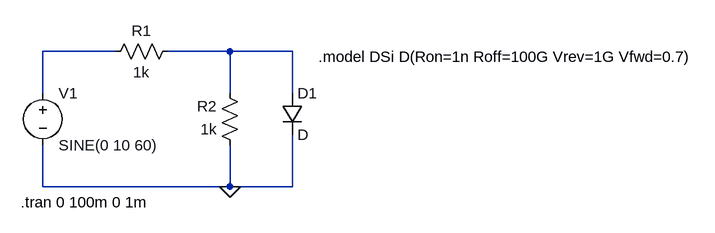
[diagram p0: schematic LucasSantosdeLuccaExercicio18.asc]
LucasSantosdeLuccaExercicio18.asc, the LTspice schematic file:
Version 4
SHEET 1 1020 680
WIRE 80 32 -32 32
WIRE 256 32 160 32
WIRE 352 32 256 32
WIRE -32 96 -32 32
WIRE 256 96 256 32
WIRE 352 96 352 32
WIRE -32 240 -32 176
WIRE 256 240 256 176
WIRE 256 240 -32 240
WIRE 352 240 352 160
WIRE 352 240 256 240
FLAG 256 240 0
SYMBOL voltage -32 80 R0
WINDOW 123 0 0 Left 0
WINDOW 39 0 0 Left 0
SYMATTR InstName V1
SYMATTR Value SINE(0 10 60)
SYMBOL res 176 16 R90
WINDOW 0 0 56 VBottom 2
WINDOW 3 32 56 VTop 2
SYMATTR InstName R1
SYMATTR Value 1k
SYMBOL res 272 192 R180
WINDOW 0 36 76 Left 2
WINDOW 3 36 40 Left 2
SYMATTR InstName R2
SYMATTR Value 1k
SYMBOL diode 336 96 R0
SYMATTR InstName D1
TEXT 392 40 Left 2 !.model DSi D(Ron=1n Roff=100G Vrev=1G Vfwd=0.7)
TEXT -66 264 Left 2 !.tran 0 100m 0 1m

The netlist it stands for:
* LucasSantosdeLuccaExercicio18.asc
V1 N001 0 SINE(0 10 60)
R1 N002 N001 1k
R2 0 N002 1k
D1 N002 0 D
.model D D
.lib standard.dio
.model DSi D(Ron=1n Roff=100G Vrev=1G Vfwd=0.7)
.tran 0 100m 0 1m
.backanno
.end